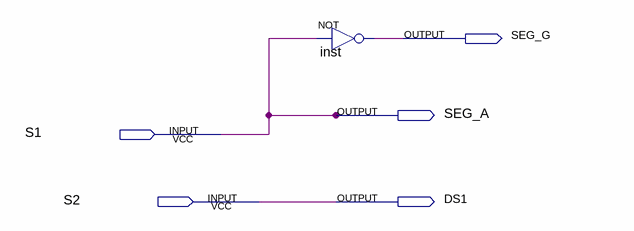
[diagram p0: schematic sheet]
// Quartus schematic main.bdf as structural Verilog: 1 symbols, 5 pins
module main (
  input  S1,
  input  S2,
  output SEG_G,
  output SEG_A,
  output DS1
);

  not inst (SEG_G, S1);

  assign DS1 = S2;
  assign SEG_A = S1;
endmodule
